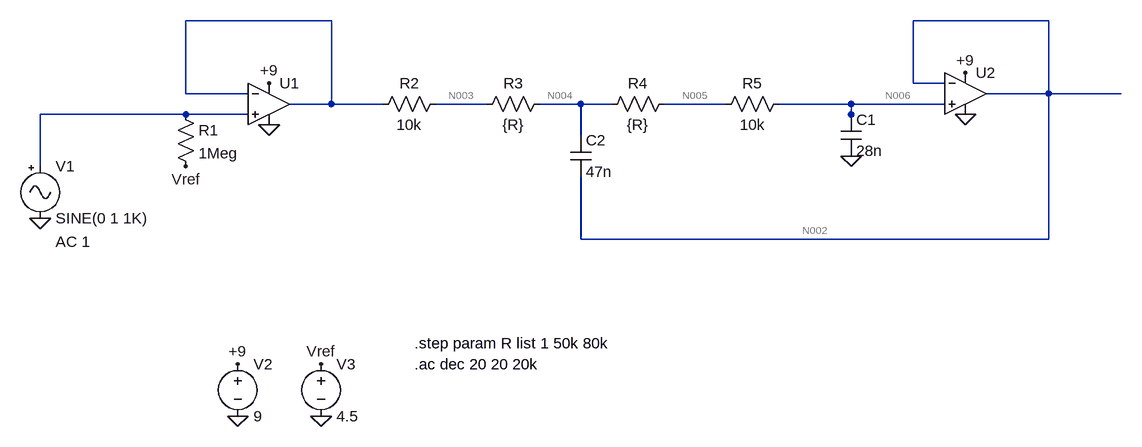
[diagram p0: schematic Draft3.asc]
Draft3.asc, the LTspice schematic file:
Version 4
SHEET 1 1732 680
WIRE 512 -144 288 -144
WIRE 1616 -144 1408 -144
WIRE 1408 -48 1408 -144
WIRE 1456 -48 1408 -48
WIRE 288 -32 288 -144
WIRE 384 -32 288 -32
WIRE 1616 -32 1616 -144
WIRE 1616 -32 1520 -32
WIRE 1728 -32 1616 -32
WIRE 512 -16 512 -144
WIRE 512 -16 448 -16
WIRE 592 -16 512 -16
WIRE 752 -16 672 -16
WIRE 896 -16 832 -16
WIRE 944 -16 896 -16
WIRE 1120 -16 1024 -16
WIRE 1312 -16 1200 -16
WIRE 1456 -16 1312 -16
WIRE 288 0 64 0
WIRE 384 0 288 0
WIRE 1312 0 1312 -16
WIRE 1312 16 1312 0
WIRE 896 32 896 -16
WIRE 64 80 64 0
WIRE 896 192 896 96
WIRE 1616 192 1616 -32
WIRE 1616 192 896 192
FLAG 64 160 0
FLAG 416 16 0
FLAG 368 464 0
FLAG 368 384 +9
FLAG 416 -48 +9
FLAG 1488 0 0
FLAG 1488 -64 +9
FLAG 496 464 0
FLAG 496 384 Vref
FLAG 288 80 Vref
FLAG 1312 64 0
SYMBOL Misc\\signal 64 64 R0
WINDOW 123 24 132 Left 2
WINDOW 39 0 0 Left 0
SYMATTR InstName V1
SYMATTR Value2 AC 1
SYMBOL OpAmps\\UniversalOpAmp 416 -16 R0
SYMATTR InstName U1
SYMBOL voltage 368 368 R0
WINDOW 123 0 0 Left 0
WINDOW 39 0 0 Left 0
SYMATTR InstName V2
SYMATTR Value 9
SYMBOL OpAmps\\UniversalOpAmp 1488 -32 R0
SYMATTR InstName U2
SYMBOL voltage 496 368 R0
WINDOW 123 0 0 Left 0
WINDOW 39 0 0 Left 0
SYMATTR InstName V3
SYMATTR Value 4.5
SYMBOL res 272 -16 R0
SYMATTR InstName R1
SYMATTR Value 1Meg
SYMBOL res 688 -32 R90
WINDOW 0 0 56 VBottom 2
WINDOW 3 32 56 VTop 2
SYMATTR InstName R2
SYMATTR Value 10k
SYMBOL res 848 -32 R90
WINDOW 0 0 56 VBottom 2
WINDOW 3 32 56 VTop 2
SYMATTR InstName R3
SYMATTR Value {R}
SYMBOL res 1040 -32 R90
WINDOW 0 0 56 VBottom 2
WINDOW 3 32 56 VTop 2
SYMATTR InstName R4
SYMATTR Value {R}
SYMBOL res 1216 -32 R90
WINDOW 0 0 56 VBottom 2
WINDOW 3 32 56 VTop 2
SYMATTR InstName R5
SYMATTR Value 10k
SYMBOL cap 1296 0 R0
SYMATTR InstName C1
SYMATTR Value 28n
SYMBOL cap 880 32 R0
SYMATTR InstName C2
SYMATTR Value 47n
TEXT 640 352 Left 2 !.step param R list 1 50k 80k
TEXT 640 384 Left 2 !.ac dec 20 20 20k

The netlist it stands for:
* Draft3.asc
V1 N007 0 SINE(0 1 1K) AC 1
XU1 N007 N001 +9 0 N001 level1 Avol=1Meg GBW=10Meg Vos=0 En=0 Enk=0 In=0 Ink=0 Rin=500Meg  ; pins In+ In- V+ V- OUT
V2 +9 0 9
XU2 N006 N002 +9 0 N002 level1 Avol=1Meg GBW=10Meg Vos=0 En=0 Enk=0 In=0 Ink=0 Rin=500Meg  ; pins In+ In- V+ V- OUT
V3 Vref 0 4.5
R1 N007 Vref 1Meg
R2 N003 N001 10k
R3 N004 N003 {R}
R4 N005 N004 {R}
R5 N006 N005 10k
C1 N006 0 28n
C2 N004 N002 47n
.step param R list 1 50k 80k
.ac dec 20 20 20k
.lib UniversalOpAmp1.lib
.backanno
.end

* Results of the author's LTspice run, read from the files saved beside the schematic
* Operating Point (first step), zero values left out:
*   r = 1 
*   V(+9) = 9 V
*   V(n002) = 180 µV
*   V(n006) = 180 µV
*   V(vref) = 4.5 V
*   V(n003) = 90 µV
*   V(n004) = 90.01 µV
*   V(n005) = 90.01 µV
*   I(R5) = 9 nA
*   I(R4) = 9 nA
*   I(R3) = 9 nA
*   I(R2) = 9 nA
*   I(R1) = -4.5 µA
*   I(V3) = -4.5 µA
*   I(V2) = -36 nA
*   I(V1) = 4.509 µA
*   Ix(u1:1) = -9 nA
*   Ix(u1:2) = -9 nA
*   Ix(u1:3) = 18 nA
*   Ix(u1:5) = 18.63 nA
*   Ix(u2:1) = -9 nA
*   Ix(u2:2) = -9 nA
*   Ix(u2:3) = 18 nA
*   Ix(u2:5) = 8.663 nA
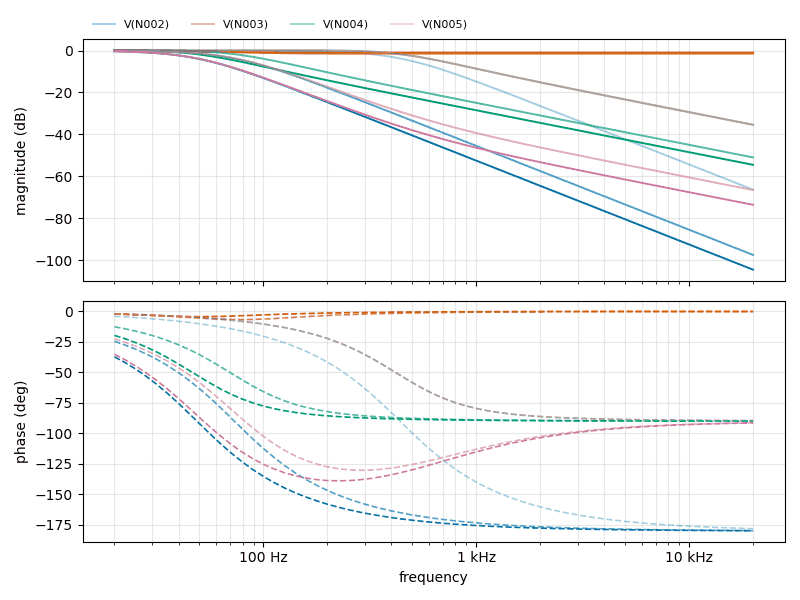
[diagram p1: AC Analysis of Draft3.asc, plotted from the saved traces]
* AC Analysis, 3 runs:
*   V(N002) [run 1]: -0.00 dB at 20 Hz, -66.36 dB at 20 kHz, peak -0.00 dB at 20 Hz, 3 dB below the peak at 399.1 Hz
*   V(N002) [run 2]: -0.15 dB at 20 Hz, -97.48 dB at 20 kHz, peak -0.15 dB at 20 Hz, 3 dB below the peak at 67.6 Hz
*   V(N002) [run 3]: -0.39 dB at 20 Hz, -104.52 dB at 20 kHz, peak -0.39 dB at 20 Hz, 3 dB below the peak at 46.49 Hz
*   V(N003) [run 1]: 0.00 dB at 20 Hz, -35.43 dB at 20 kHz, peak 0.05 dB at 141.6 Hz, 3 dB below the peak at 529.8 Hz
*   V(N003) [run 2]: -0.02 dB at 20 Hz, -1.58 dB at 20 kHz, peak -0.02 dB at 20 Hz
*   V(N003) [run 3]: -0.05 dB at 20 Hz, -1.02 dB at 20 kHz, peak -0.05 dB at 20 Hz
*   V(N004) [run 1]: 0.00 dB at 20 Hz, -35.42 dB at 20 kHz, peak 0.05 dB at 141.6 Hz, 3 dB below the peak at 529.8 Hz
*   V(N004) [run 2]: 0.04 dB at 20 Hz, -50.99 dB at 20 kHz, peak 0.05 dB at 22.44 Hz, 3 dB below the peak at 88.44 Hz
*   V(N004) [run 3]: 0.03 dB at 20 Hz, -54.51 dB at 20 kHz, peak 0.03 dB at 20 Hz, 3 dB below the peak at 59.02 Hz
*   V(N005) [run 1]: 0.00 dB at 20 Hz, -35.43 dB at 20 kHz, peak 0.05 dB at 141.6 Hz, 3 dB below the peak at 529.8 Hz
*   V(N005) [run 2]: -0.14 dB at 20 Hz, -66.55 dB at 20 kHz, peak -0.14 dB at 20 Hz, 3 dB below the peak at 68.12 Hz
*   V(N005) [run 3]: -0.38 dB at 20 Hz, -73.59 dB at 20 kHz, peak -0.38 dB at 20 Hz, 3 dB below the peak at 46.63 Hz